# Altium schematic sheet X_line_07.SchDoc
size A2; SheetNumber: 2; SheetTotal: 9
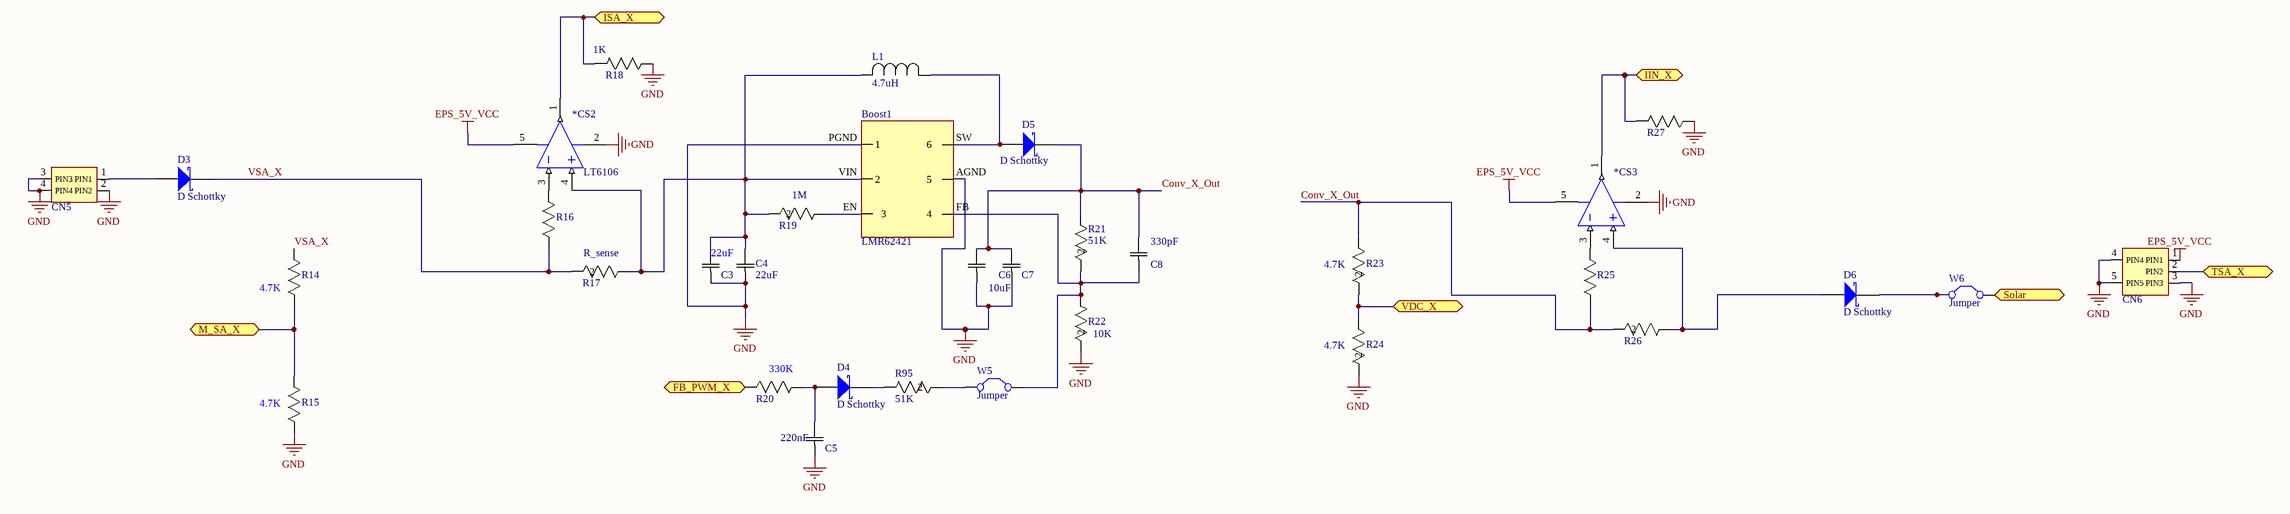
[diagram p0: X_line_07.SchDoc]

## Parts
*CS2  LT6106  [LT-S5-5-TSOT-23_N]
*CS3  CS3  [LT-S5-5-TSOT-23_N]  (value not drawn)
Boost1  LMR62421  [LMR62421]
C3  value 22uF  [RC0805N]  (hidden comment: GRM155R71H103KA8)
C4  22uF  [RC0805N]
C5  220nF  [RC0805N]
C6  10uF  [RC0805N]
C7  GRM155R71H103KA8  [RC0805N]  (value not drawn)
C8  330pF  [RC0805N]
CN5  SM02B-SRSS  [2pins]  (value not drawn)
CN6  SM03B-SRSS  [3pins]  (value not drawn)
D3  D Schottky  [SMB]
D4  D Schottky  [SMB]
D5  D Schottky  [SMB]
D6  D Schottky  [SMB]
L1  4.7uH  [IND_SPM6530]
R14  Resistance_(Ohms): 4.7K  [RC0805N]  (hidden comment: RC0805FR)
R15  Resistance_(Ohms): 4.7K  [RC0805N]  (hidden comment: RC0805FR)
R16  1K  [RC0805N]  (value not drawn)
R17  R_sense  [RC0805N]
R18  1K  [RC0805N]
R19  1M  [RC0805N]
R20  Resistance_(Ohms): 330K  [RC0805N]  (hidden comment: RC0805FR)
R21  51K  [RC0805N]
R22  10K  [RC0805N]
R23  4.7K  [RC0805N]
R24  4.7K  [RC0805N]
R25  RC0805FR  [RC0805N]  (value not drawn)
R26  RL0805FR-070R1L  [RC0805N]  (value not drawn)
R27  RC0805FR  [RC0805N]  (value not drawn)
R95  51K  [RC0805N]
W5  Jumper  [RAD-0.1]
W6  Jumper  [RAD-0.1]

## Ports
FB_PWM_X, IIN_X, ISA_X, M_SA_X, Solar, TSA_X, VDC_X

## Nets
EPS_5V_VCC: *CS2.5(V+) *CS3.5(V+) CN6.1(PIN1)
GND: *CS2.2(V-) *CS3.2(V-) Boost1.AGND(5) Boost1.PGND(1) C3.1 C4.1 C5.1 C6.1 C7.1 CN5.2(PIN2) CN5.3(PIN3) CN5.4(PIN4) CN6.3(PIN3) CN6.4(PIN4) CN6.5(PIN5) R15.2 R18.2 R22.2 R24.2 R27.2
Conv_X_Out: C6.2 C7.2 C8.2 D5.2(K) R21.1 R23.1 R25.2 R26.2
FB_PWM_X: R20.2 ; port FB_PWM_X
IIN_X: *CS3.1(OUT) R27.1 ; port IIN_X
ISA_X: *CS2.1(OUT) R18.1 ; port ISA_X
M_SA_X: R14.2 R15.1 ; port M_SA_X
Solar: W6.2(C2) ; port Solar
TSA_X: CN6.2(PIN2) ; port TSA_X
VDC_X: R23.2 R24.1 ; port VDC_X
VSA_X: D3.2(K) R14.1 R16.2 R17.2
Net*CS2_3: *CS2.3(-IN) R16.1
Net*CS2_4: *CS2.4(+IN) Boost1.VIN(2) C3.2 C4.2 L1.2 R17.1 R19.2
Net*CS3_3: *CS3.3(-IN) R25.1
Net*CS3_4: *CS3.4(+IN) D6.1(A) R26.1
NetBoost1_EN: Boost1.EN(3) R19.1
NetBoost1_FB: Boost1.FB(4) C8.1 R21.2 R22.1 W5.2(C2)
NetBoost1_SW: Boost1.SW(6) D5.1(A) L1.1
NetC5_2: C5.2 D4.1(A) R20.1
NetCN5_1: CN5.1(PIN1) D3.1(A)
NetD4_2: D4.2(K) R95.1
NetD6_2: D6.2(K) W6.1(C1)
NetR95_2: R95.2 W5.1(C1)

## Library data of the parts
*CS2 = LT6106HS5#TRMPBF: Single Channel, Low Cost, High Side Current Sense Operational Amplifier, 0.2 MHz Typical GBW, 5-Pin SOT-23 (S5-5), High Temperature / Automotive, Pb-Free, Mini Reel; Manufacturer: Linear Technology; Channels (#): 1; GBW (MHz) Typical: 0.2; Is (mA) Typical: 0.06; Vos (mV) Guaranteed: 0.25; Vos (mV) Typical: 0.15; Vs Max (V): 36; Vs Min (V): 2.7; DatasheetVersion: Rev. A; PackageReference: LT-S5-5-TSOT-23; PackageDescription: 5-Lead Plastic TSOT-23, Body 1.63 x 2.90 mm, Pitch 0.95 mm; Supplier 1: Digi-Key; Supplier Part Number 1: LT6106HS5#TRMPBFTR-ND; Supplier 2: Digi-Key; Supplier Part Number 2: LT6106HS5#TRMPBFCT-ND; Supplier 3: Digi-Key; Supplier Part Number 3: LT6106HS5#TRMPBFDKR-ND; Supplier 4: Farnell; Supplier Part Number 4: 1663842; Supplier 5: Farnell; Supplier Part Number 5: 1663842RL; Supplier 6: Newark; Supplier Part Number 6: 57M9138; Packing: Mini Reel; Linear Technology Part Number: LT6106; RoHS: Pb-Free; Type: CSA; Mounting Technology: Surface Mount; Code_JEDEC: MO-193; PartNumber: LT6106HS5#TRMPBF; ComponentLink1Description: Manufacturer URL; ComponentLink1URL: http://www.linear.com/; ComponentLink2Description: Datasheet; ComponentLink2URL: http://cds.linear.com/docs/en/datasheet/6106fa.pdf; ComponentLink3Description: Package Specification; ComponentLink3URL: http://cds.linear.com/docs/en/packaging/SOT_5_05-08-1635.pdf
*CS3 = LT6106HS5#TRMPBF: Single Channel, Low Cost, High Side Current Sense Operational Amplifier, 0.2 MHz Typical GBW, 5-Pin SOT-23 (S5-5), High Temperature / Automotive, Pb-Free, Mini Reel; Linear Technology Part Number: LT6106; Manufacturer: Linear Technology; Channels (#): 1; GBW (MHz) Typical: 0.2; Is (mA) Typical: 0.06; Vos (mV) Guaranteed: 0.25; Vos (mV) Typical: 0.15; Vs Max (V): 36; Vs Min (V): 2.7; DatasheetVersion: Rev. A; PackageReference: LT-S5-5-TSOT-23; PackageDescription: 5-Lead Plastic TSOT-23, Body 1.63 x 2.90 mm, Pitch 0.95 mm; Supplier 1: Digi-Key; Supplier Part Number 1: LT6106HS5#TRMPBFTR-ND; Supplier 2: Digi-Key; Supplier Part Number 2: LT6106HS5#TRMPBFCT-ND; Supplier 3: Digi-Key; Supplier Part Number 3: LT6106HS5#TRMPBFDKR-ND; Supplier 4: Farnell; Supplier Part Number 4: 1663842; Supplier 5: Farnell; Supplier Part Number 5: 1663842RL; Supplier 6: Newark; Supplier Part Number 6: 57M9138; Packing: Mini Reel; RoHS: Pb-Free; Type: CSA; Mounting Technology: Surface Mount; Code_JEDEC: MO-193; PartNumber: LT6106HS5#TRMPBF; ComponentLink1Description: Manufacturer URL; ComponentLink1URL: http://www.linear.com/; ComponentLink2Description: Datasheet; ComponentLink2URL: http://cds.linear.com/docs/en/datasheet/6106fa.pdf; ComponentLink3Description: Package Specification; ComponentLink3URL: http://cds.linear.com/docs/en/packaging/SOT_5_05-08-1635.pdf
Boost1 = Component_1: LMR62421XSDDEMO: 12V @ 500mA, 2.7 ~ 5.5V in
C3 C7 = GRM155R71H103KA8: Ceramic Capacitor 0402; Manufacturer_Part_Number: GRM155R71H103KA88D; Vendor: Murata; C: Copyright (C) 2015 Accelerated Designs. All rights reserved; Copyright: Copyright (C) 2015 Accelerated Designs. All rights reserved; Package/Case: 0402(1005metric)
  C7: Value: Value
C4 C8 = GRM155R71H103KA8: Ceramic Capacitor; Manufacturer_Part_Number: GRM155R71H103KA88D; Vendor: Murata; C: Copyright (C) 2015 Accelerated Designs. All rights reserved; Copyright: Copyright (C) 2015 Accelerated Designs. All rights reserved; Value: Value; Package/Case: 0402(1005metric)
C5 C6 = GRM188R71H472KA0: Ceramic Capacitor 47uF 0603; Manufacturer_Part_Number: GRM188R71H472KA01D; Vendor: Murata; C: Copyright (C) 2015 Accelerated Designs. All rights reserved; Copyright: Copyright (C) 2015 Accelerated Designs. All rights reserved; Package/Case: 0603 (1608 Metric)
  C5: Value: 220nF
  C6: Value: Value
CN5 = 2Pin_Connector: CONN HEADER SH 2POS SIDE 1MM TIN; Manufacturer Part Number: SM02B-SRSS-TB(LF)(SN); Manufacturer: JST Sales America Inc.; Digi-Key Part Number: 455-1802-1-ND; Contact Type: Male Pin
CN6 = 3PIN_Connector: CONN HEADER SH 3POS SIDE 1MM TIN; Manufacturer Part Number: SM03B-SRSS-TB(LF)(SN); Manufacturer: JST Sales America Inc.; Digi-Key Part Number: 455-1803-1-ND; Contact Type: Male Pin; Mounting Type: Surface Mount, Right Angle
D3-D6 = D Schottky: Schottky Diode, 1A; Published: 8-Jun-2000; LatestRevisionDate: 17-Jul-2002; LatestRevisionNote: Re-released for DXP Platform.; PackageReference: SMB; Publisher: Altium Limited; PackageDescription: DO-214-AA/SMB; 2 C-Bend Leads; Body 5.3 x 3.6 mm, inc. leads (LxW); Code_JEDEC: DO-214-AA
L1 = SPM6530T-4R7M: Inductor, 4.7uH; Vendor: TDK; C: Copyright (C) 2015 Accelerated Designs. All rights reserved; Manufacturer_Part_Number: SPM6530T-4R7M; Copyright: Copyright (C) 2015 Accelerated Designs. All rights reserved; Value: Value
R14 R15 R23 R24 = RC0805FR: Thick Film Resistors 0805; Manufacturer_Part_Number: RC0805FR-074K7L; Vendor: Yageo; Resistance_In_Ohms: 4.70K; Power_(Watts): 0.125W, 1/8W; Tolerance: Â±1%; Lead_Style: Surface Mount (SMD - SMT); Voltage_-_Working: 150V; Temperature_Coefficient: Â±100ppm/Â°C; Number_of_Terminations: 2; C: Copyright (C) 2015 Accelerated Designs. All rights reserved; DigiKeyPartNumber: 311-4.70KCRTR-ND; Quantity_Available: 0; Copyright: Copyright (C) 2015 Accelerated Designs. All rights reserved; DataSheet: http://www.yageo.com/documents/recent/PYu-RC0805_51_RoHS_L_4.pdf; Case: 0805 (2012 metric); Packaging: Tape &amp; Reel (TR); Composition: Thick Film; NewarkPartNumber: 10R0398; Features: -; Package_/_Case: 0805 (2012 Metric); Size_/_Dimension: 0.079" L x 0.049" W (2.00mm x 1.25mm); Height: 0.024" (0.60mm); Value: Value
  R23 R24: Resistance_(Ohms): 4.7K
R16 R20 = RC0805FR: Thick Film Resistors 0805; Manufacturer_Part_Number: RC0805FR-074K7L; Vendor: Yageo; Power_(Watts): 0.125W, 1/8W; Tolerance: Â±1%; Lead_Style: Surface Mount (SMD - SMT); Voltage_-_Working: 150V; Temperature_Coefficient: Â±100ppm/Â°C; Number_of_Terminations: 2; C: Copyright (C) 2015 Accelerated Designs. All rights reserved; DigiKeyPartNumber: 311-4.70KCRTR-ND; Quantity_Available: 0; Copyright: Copyright (C) 2015 Accelerated Designs. All rights reserved; DataSheet: http://www.yageo.com/documents/recent/PYu-RC0805_51_RoHS_L_4.pdf; Case: 0805 (2012 metric); Packaging: Tape &amp; Reel (TR); Composition: Thick Film; NewarkPartNumber: 10R0398; Features: -; Package_/_Case: 0805 (2012 Metric); Size_/_Dimension: 0.079" L x 0.049" W (2.00mm x 1.25mm); Height: 0.024" (0.60mm); Value: Value
  R16: Resistance_In_Ohms: 1K; Resistance_(Ohms): 1K
  R20: Resistance_In_Ohms: 330K
R17 R26 = RL0805FR-070R1L: Sense Resistor 100m ohm 0805; Vendor: Yageo; Resistance_In_Ohms: 0.10; Power_(Watts): 0.125W, 1/8W; Tolerance: Â±1%; Lead_Style: Surface Mount (SMD - SMT); Voltage_-_Working: 300V; Temperature_Coefficient: Â±600ppm/Â°C; Resistance_(Ohms): 0.1; Number_of_Terminations: 2; C: Copyright (C) 2015 Accelerated Designs. All rights reserved; DigiKeyPartNumber: 311-.10STR-ND; Manufacturer_Part_Number: RL0805FR-070R1L; Quantity_Available: 25000; Copyright: Copyright (C) 2015 Accelerated Designs. All rights reserved; DataSheet: http://www.yageo.com/documents/recent/PYu-RL_521_RoHS_L_5.pdf; Case: 0805 (2012 metric); Packaging: Tape &amp; Reel (TR); Composition: Thick Film; NewarkPartNumber: 66R6321; Features: Current Sense; Package_/_Case: 0805 (2012 Metric); Size_/_Dimension: 0.079" L x 0.049" W (2.00mm x 1.25mm); Height: 0.024" (0.60mm); Value: Value
R18 R19 R21 R22 R25 R27 R95 = RC0805FR: Thick Film Resistors 0805; Manufacturer_Part_Number: RC0805FR-074K7L; Vendor: Yageo; Resistance_In_Ohms: 4.70K; Power_(Watts): 0.125W, 1/8W; Tolerance: Â±1%; Lead_Style: Surface Mount (SMD - SMT); Voltage_-_Working: 150V; Temperature_Coefficient: Â±100ppm/Â°C; Resistance_(Ohms): 4.7K; Number_of_Terminations: 2; C: Copyright (C) 2015 Accelerated Designs. All rights reserved; DigiKeyPartNumber: 311-4.70KCRTR-ND; Quantity_Available: 0; Copyright: Copyright (C) 2015 Accelerated Designs. All rights reserved; DataSheet: http://www.yageo.com/documents/recent/PYu-RC0805_51_RoHS_L_4.pdf; Case: 0805 (2012 metric); Packaging: Tape &amp; Reel (TR); Composition: Thick Film; NewarkPartNumber: 10R0398; Features: -; Package_/_Case: 0805 (2012 Metric); Size_/_Dimension: 0.079" L x 0.049" W (2.00mm x 1.25mm); Height: 0.024" (0.60mm); Value: Value
W5 W6 = Jumper: Jumper Wire; Published: 24-Mar-1999; LatestRevisionDate: 17-Jul-2002; LatestRevisionNote: Re-released for DXP Platform.; PackageReference: RAD-0.2; Publisher: Altium Limited; PackageDescription: Radial Cap, Thru-Hole; 2 Leads; 0.2 in Pin Spacing